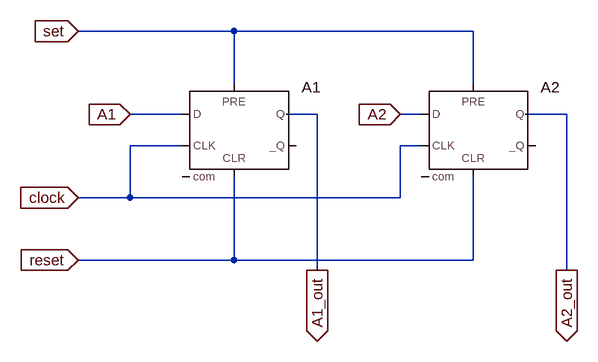
[diagram p0: schematic dflipflop_2bit_con_set_reset.asc]
dflipflop_2bit_con_set_reset.asc, the LTspice schematic file:
Version 4
SHEET 1 880 680
WIRE 96 48 -144 48
WIRE 464 48 96 48
WIRE 96 128 96 48
WIRE 464 128 464 48
WIRE 16 176 -64 176
WIRE 224 176 176 176
WIRE 384 176 352 176
WIRE 608 176 544 176
WIRE 16 224 -64 224
WIRE 384 224 352 224
WIRE -64 304 -64 224
WIRE -64 304 -144 304
WIRE 352 304 352 224
WIRE 352 304 -64 304
WIRE 96 400 96 272
WIRE 96 400 -144 400
WIRE 464 400 464 272
WIRE 464 400 96 400
WIRE 224 416 224 176
WIRE 608 416 608 176
FLAG -64 176 A1
IOPIN -64 176 In
FLAG 352 176 A2
IOPIN 352 176 In
FLAG -144 304 clock
IOPIN -144 304 In
FLAG 224 416 A1_out
IOPIN 224 416 Out
FLAG 608 416 A2_out
IOPIN 608 416 Out
FLAG -144 400 reset
IOPIN -144 400 In
FLAG -144 48 set
IOPIN -144 48 In
SYMBOL Digital\\dflop 96 128 R0
SYMATTR InstName A1
SYMBOL Digital\\dflop 464 128 R0
SYMATTR InstName A2

The netlist it stands for:
* dflipflop_2bit_con_set_reset.asc
A1 A1 0 clock set reset 0 A1_out 0 DFLOP
A2 A2 0 clock set reset 0 A2_out 0 DFLOP
.backanno
.end